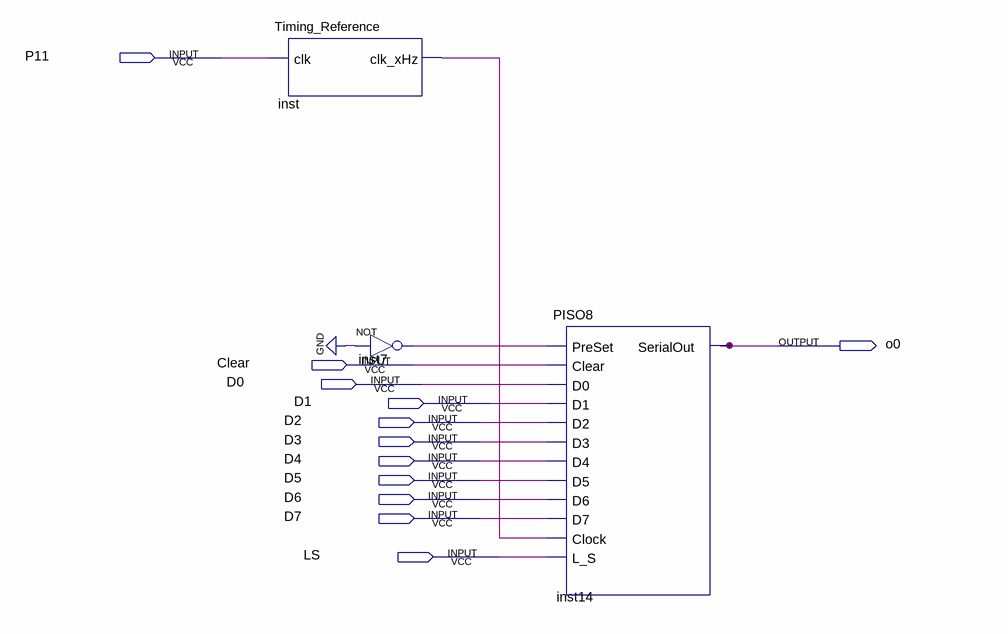
[diagram p0: schematic sheet]
// Quartus schematic Lab3.bdf as structural Verilog: 3 symbols, 12 pins
module Lab3 (
  input  P11,
  input  Clear,
  input  D0,
  input  D1,
  input  D2,
  input  D3,
  input  D4,
  input  D5,
  input  D6,
  input  D7,
  input  LS,
  output o0
);

  wire inst7_out, inst_clk_xhz;

  Timing_Reference inst (.clk(P11), .clk_xHz(inst_clk_xhz));
  not inst7 (inst7_out, 1'b0);
  PISO8 inst14 (
    .PreSet(inst7_out), .Clear(Clear), .D0(D0), .D1(D1), .D2(D2), .D3(D3), .D4(D4), .D5(D5), .D6(D6),
    .D7(D7), .Clock(inst_clk_xhz), .L_S(LS), .SerialOut(o0));
endmodule
